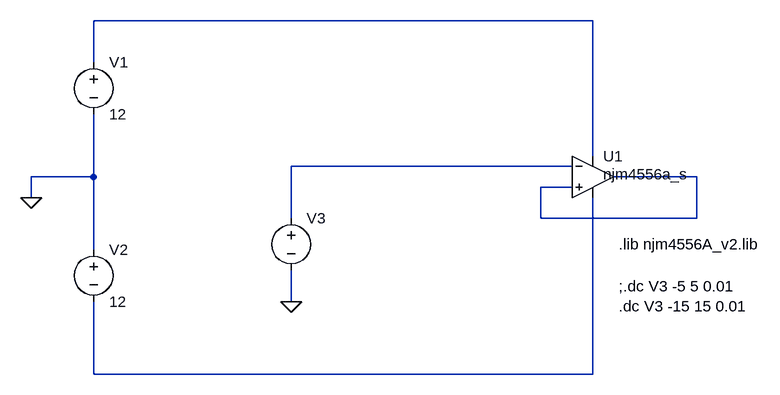
[diagram p0: schematic prelab3_starter.asc]
prelab3_starter.asc, the LTspice schematic file:
Version 4
SHEET 1 1320 808
WIRE 160 -848 -608 -848
WIRE -608 -784 -608 -848
WIRE 160 -640 160 -848
WIRE 128 -624 -304 -624
WIRE -608 -608 -608 -704
WIRE -608 -608 -704 -608
WIRE 320 -608 192 -608
WIRE 128 -592 80 -592
WIRE -704 -576 -704 -608
WIRE -304 -544 -304 -624
WIRE 80 -544 80 -592
WIRE 320 -544 320 -608
WIRE 320 -544 80 -544
WIRE -608 -496 -608 -608
WIRE -304 -416 -304 -464
WIRE -608 -304 -608 -416
WIRE 160 -304 160 -576
WIRE 160 -304 -608 -304
FLAG -304 -416 0
FLAG -704 -576 0
SYMBOL voltage -304 -560 R0
WINDOW 123 24 44 Left 2
WINDOW 39 0 0 Left 2
SYMATTR InstName V3
SYMATTR Value ""
SYMBOL opamp2 160 -672 R0
WINDOW 3 16 96 Invisible 2
WINDOW 38 16 60 Left 2
SYMATTR Value ""
SYMATTR SpiceModel njm4556a_s
SYMATTR InstName U1
SYMBOL voltage -608 -800 R0
WINDOW 123 0 0 Left 2
WINDOW 39 0 0 Left 2
SYMATTR InstName V1
SYMATTR Value 12
SYMBOL voltage -608 -512 R0
WINDOW 123 0 0 Left 2
WINDOW 39 0 0 Left 2
SYMATTR InstName V2
SYMATTR Value 12
TEXT 200 -504 Left 2 !.lib njm4556A_v2.lib
TEXT 200 -440 Left 2 !;.dc V3 -5 5 0.01\n.dc V3 -15 15 0.01

The netlist it stands for:
* prelab3_starter.asc
V3 N002 0
XU1 N003 N002 N001 N004 N003 njm4556a_s  ; pins In+ In- V+ V- OUT
V1 N001 0 12
V2 0 N004 12
.lib njm4556A_v2.lib
;.dc V3 -5 5 0.01
.dc V3 -15 15 0.01
.backanno
.end